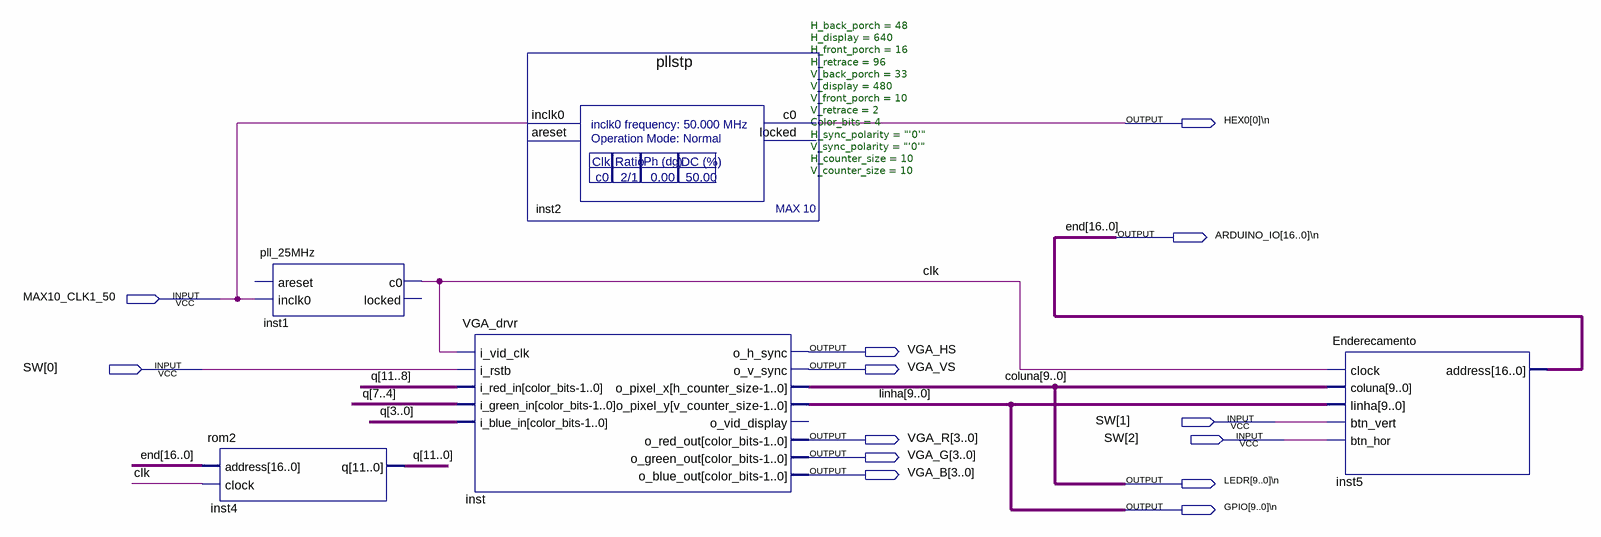
[diagram p0: schematic sheet]
// Quartus schematic vga1.bdf as structural Verilog: 5 symbols, 13 pins
module vga1 (
  input  MAX10_CLK1_50,
  input  [2:0] SW,
  output \HEX0[0]\n ,
  output \ARDUINO_IO[16..0]\n ,
  output VGA_HS,
  output VGA_VS,
  output [3:0] VGA_R,
  output [3:0] VGA_G,
  output [3:0] VGA_B,
  output \LEDR[9..0]\n ,
  output \GPIO[9..0]\n 
);

  wire clk;
  wire [9:0] coluna, linha;
  wire [11:0] q;
  wire [16:0] \end ;

  rom2 inst4 (.address(\end ), .clock(clk), .q(q));
  pll_25MHz inst1 (.inclk0(MAX10_CLK1_50), .c0(clk));  // open: areset, locked
  VGA_drvr #(.H_back_porch(48), .H_display(640), .H_front_porch(16), .H_retrace(96), .V_back_porch(33), .V_display(480), .V_front_porch(10), .V_retrace(2), .Color_bits(4), .H_sync_polarity("'0'"), .V_sync_polarity("'0'"), .H_counter_size(10), .V_counter_size(10)) inst (
    .i_vid_clk(clk), .i_rstb(SW[0]), .i_red_in(q[11:8]), .i_green_in(q[7:4]), .i_blue_in(q[3:0]),
    .o_h_sync(VGA_HS), .o_v_sync(VGA_VS), .o_pixel_x(coluna), .o_pixel_y(linha), .o_red_out(VGA_R),
    .o_green_out(VGA_G), .o_blue_out(VGA_B));  // open: o_vid_display
  pllstp inst2 (.inclk0(MAX10_CLK1_50), .c0(\HEX0[0]\n ));  // open: areset, locked
  Enderecamento inst5 (.clock(clk), .coluna(coluna), .linha(linha), .btn_vert(SW[1]), .btn_hor(SW[2]), .address(\end ));
endmodule
